# Altium project iPlug1.0.PrjPcb
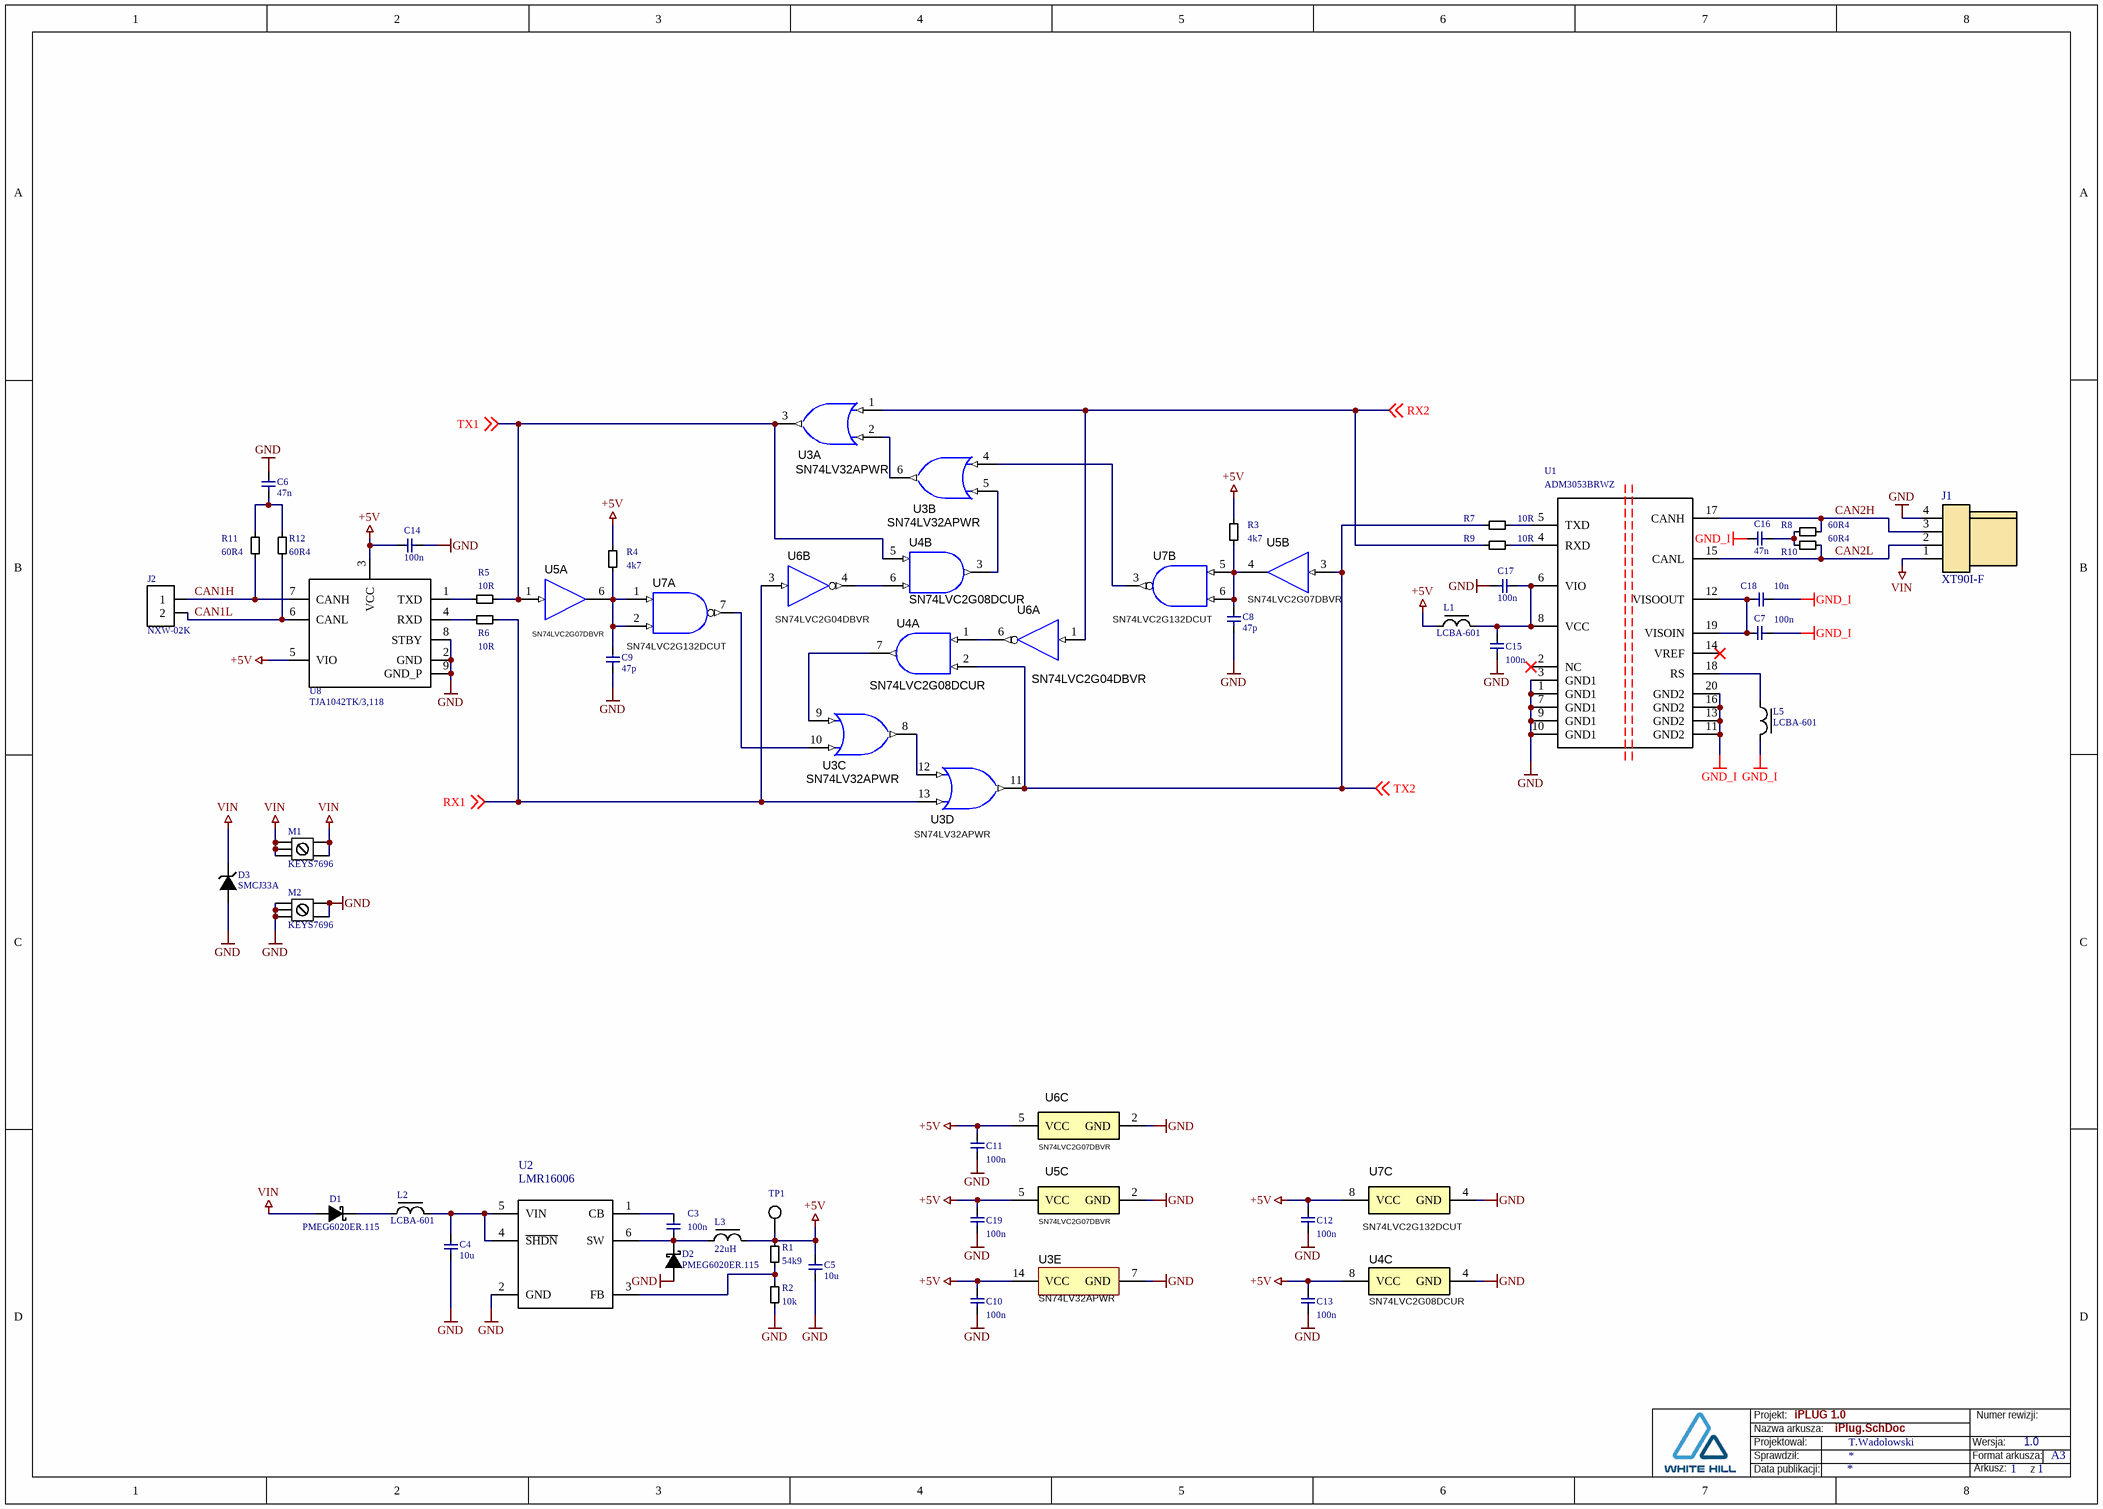
[diagram p0: iPlug.SchDoc]
PRJ_Title: iPLUG 1.0
1 sheet, 50 parts. Net scope: global (net labels, ports and power ports of the same name join across sheets).
Board file: iPlug.PcbDoc

## Sheet iPlug.SchDoc
size A3; Engineer: T.Wadolowski; Address1: ul. Żurawia 71; Address2: 15-540 Bialystok; DocumentNumber: 1.0; SheetNumber: 1; SheetTotal: 1

### Parts
(Parts that share a designator on the sheet are numbered #1, #2 ... from top to bottom, then left to right.)
C3  100n  [C0603]
C4  10u  [C1206]
C5  10u  [C1206]
C6  47n  [C0603]
C7  100n  [C0603]
C8  47p  [C0603]
C9  47p  [C0603]
C10  100n  [C0603]
C11  100n  [C0603]
C12  100n  [C0603]
C13  100n  [C0603]
C14  100n  [C0603]
C15  100n  [C0603]
C16  47n  [C0603]
C17  100n  [C0603]
C18  10n  [C0603]
C19  100n  [C0603]
D1  PMEG6020ER.115  [SOD123]
D2  PMEG6020ER.115  [SOD123]
D3  SMCJ33A  [DO-214AC]
J1  XT90I-F  (graphical)
J2  NXW-02K  [JST-2-2-H]
L1  LCBA-601  [R0603]
L2  LCBA-601  [R0603]
L3  22uH  [L4040]
L5  LCBA-601  [R0603]
M1  KEYS7696  [KEY-7696]
M2  KEYS7696  [KEY-7696]
R1  54k9  [R0603]
R2  10k  [R0603]
R3  4k7  [R0603]
R4  4k7  [R0603]
R5  10R  [R0603]
R6  10R  [R0603]
R7  10R  [R0603]
R8  60R4  [R0603]
R9  10R  [R0603]
R10  60R4  [R0603]
R11  60R4  [R0603]
R12  60R4  [R0603]
TP1  TP  [TP]  (value not drawn)  (no BOM)
U1  ADM3053BRWZ  [SOIC-20-W]
U2  LMR16006  [SOT-23-6]
U3  SN74LV32APWR  [PW0014A_N]  (parts A,B,C,D,E of 5)
U4  SN74LVC2G08DCUR  [VSSOP-8-0.5]  (parts A,B,C of 3)
U5  SN74LVC2G07DBVR  [DBV0006A_N]  (parts A,B,C of 3)
U6#1  SN74LVC2G04DBVR  [DBV0006A_N]  (parts A,B of 3)
U6#2  SN74LVC2G07DBVR  [DBV0006A_N]  (part C of 3)
U7  SN74LVC2G132DCUT  [VSSOP-8-0.5]  (parts A,B,C of 3)
U8  TJA1042TK/3,118  [HVSON8]

### Nets
+5V: C5.1 C10.1 C11.1 C12.1 C13.1 C14.1 C19.1 L1.1 L3.2 R1.2(BOT) R3.2(BOT) R4.2(BOT) TP1.1 U3.14(VCC) U4.8(VCC) U5.5(VCC) U6#2.5(VCC) U7.8(VCC) U8.3(VCC) U8.5(VIO)
GND: C4.2 C5.2 C6.1 C8.2 C9.2 C10.2 C11.2 C12.2 C13.2 C14.2 C15.2 C17.2 C19.2 D2.1(A) D3.A J1.4 M2.1 M2.2 M2.3 M2.4 M2.5 R2.1(TOP) U1.1(GND1) U1.3(GND1) U1.7(GND1) U1.9(GND1) U1.10(GND1) U2.2(GND) U3.7(GND) U4.4(GND) U5.2(GND) U6#2.2(GND) U7.4(GND) U8.2(GND) U8.8(STBY) U8.9(GND_P)
GND_I: C7.2 C16.1 C18.1 L5.2 U1.11(GND2) U1.13(GND2) U1.16(GND2) U1.20(GND2)
VIN: D1.1(A) D3.K J1.1 M1.1 M1.2 M1.3 M1.4 M1.5
CAN1H: J2.1 R11.1(TOP) U8.7(CANH)
CAN1L: J2.2 R12.1(TOP) U8.6(CANL)
CAN2H: J1.3 R8.1(TOP) U1.17(CANH)
CAN2L: J1.2 R10.1(TOP) U1.15(CANL)
RX1: R6.1(TOP) U3.13(4B) U6#1.3(2A) ; off-sheet RX1
RX2: R9.2(BOT) U3.1(1A) U6#1.1(1A) ; off-sheet RX2
TX1: R5.1(TOP) U3.3(1Y) U4.5(2A) U5.1(1A) ; off-sheet TX1
TX2: R7.2(BOT) U3.11(4Y) U4.2(1B) U5.3(2A) ; off-sheet TX2
NetC3_1: C3.1 U2.1(CB)
NetC3_2: C3.2 D2.2(K) L3.1 U2.6(SW)
NetC4_1: C4.1 L2.2 U2.4(~{SHDN}) U2.5(VIN)
NetC6_2: C6.2 R11.2(BOT) R12.2(BOT)
NetC7_1: C7.1 C18.2 U1.12(VISOOUT) U1.19(VISOIN)
NetC8_1: C8.1 R3.1(TOP) U5.4(2Y) U7.5(2A) U7.6(2B)
NetC9_1: C9.1 R4.1(TOP) U5.6(1Y) U7.1(1A) U7.2(1B)
NetC15_1: C15.1 C17.1 L1.2 U1.6(VIO) U1.8(VCC)
NetC16_2: C16.2 R8.2(BOT) R10.2(BOT)
NetD1_2: D1.2(K) L2.1
NetL5_1: L5.1 U1.18(RS)
NetR1_1: R1.1(TOP) R2.2(BOT) U2.3(FB)
NetR5_2: R5.2(BOT) U8.1(TXD)
NetR6_2: R6.2(BOT) U8.4(RXD)
NetR7_1: R7.1(TOP) U1.5(TXD)
NetR9_1: R9.1(TOP) U1.4(RXD)
NetU3_2: U3.2(1B) U3.6(2Y)
NetU3_4: U3.4(2A) U7.3(2Y)
NetU3_5: U3.5(2B) U4.3(2Y)
NetU3_8: U3.8(3Y) U3.12(4A)
NetU3_9: U3.9(3A) U4.7(1Y)
NetU3_10: U3.10(3B) U7.7(1Y)
NetU4_1: U4.1(1A) U6#1.6(1Y)
NetU4_6: U4.6(2B) U6#1.4(2Y)

Not connected (* = marked no-connect by the designer): U1 2(NC)* 14(VREF)*

### Notes on the sheet
- Projekt:
- Projektował:
- Sprawdził:
- Nazwa arkusza:
- Wersja:
- Format arkusza:
- Numer rewizji:
- A3
- Data publikacji:
- Arkusz:
- z

### Library data of the parts
C3 C7 C10-C15 C17 C19 = C-013: Capacitor: ceramic; 100nF; 50V; X7R; ±10%; SMD; 0603; Series: GRM; Manufacturer: Murata; Part Number: GRM188R71H104KA93D; Indeks: C-0013; Value: 100n; ComponentLink1Description: Datasheet; ComponentLink1URL: D:\Datasheets\.pdf; Supplier: TME; Supplier Code: GRM188R71H104KA93D; ComponentLink2Description: Dostawca; ComponentLink2URL: http://www.tme.eu/pl/katalog/?idp=1&search=GRM188R71H104KA93D
C4 C5 = C-022: Capacitor: ceramic; 10uF; 35V; X7R; ±10%; SMD; 1206; Manufacturer: Samnsung; Part Number: CL31B106KLHNNNE; Indeks: C-0019; Value: 10u; ComponentLink1Description: Datasheet; ComponentLink1URL: D:\Datasheets\.pdf; Supplier: TME; Supplier Code: CL31B106KLHNNNE; ComponentLink2Description: Dostawca; ComponentLink2URL: http://www.tme.eu/pl/katalog/?idp=1&search=CL31B106KLHNNNE
C6 C16 = C-012: Capacitor: ceramic; MLCC; 47nF; 50V; X7R; ±10%; SMD; 0603; Manufacturer: Kemet; Part Number: C0603C473K5RACTU; Indeks: C-0012; Value: 47n; ComponentLink1Description: Datasheet; ComponentLink1URL: D:\Datasheets\.pdf; Supplier: TME; Supplier Code: C0603C473K5RAC; ComponentLink2Description: Dostawca; ComponentLink2URL: http://www.tme.eu/pl/katalog/?idp=1&search=C0603C473K5RAC
C8 C9 = C-004: Capacitor: ceramic; 47pF; 100V; C0G; ±5%; SMD; 0603; Manufacturer: AVX; Part Number: 06031A470JAT2A; Value: 47p; ComponentLink1Description: Datasheet; ComponentLink1URL: D:\Datasheets\.pdf; Supplier: TME; Supplier Code: 06031A470JAT2A; Indeks: C-004; ComponentLink2Description: Dostawca; ComponentLink2URL: http://www.tme.eu/pl/katalog/?idp=1&search=06031A470JAT2A
C18 = C-011: Capacitor: ceramic; MLCC; 10nF; 50V; X7R; ±5%; SMD; 0603; Manufacturer: Vishay; Part Number: VJ0603Y103JXACW1BC; Indeks: C-0011; Value: 10n; ComponentLink1Description: Datasheet; ComponentLink1URL: D:\Datasheets\.pdf; Supplier: TME; Supplier Code: VJ0603Y103JXACW1BC; ComponentLink2Description: Dostawca; ComponentLink2URL: http://www.tme.eu/pl/katalog/?idp=1&search=VJ0603Y103JXACW1BC
D1 D2 = STPS2H100A: Diode: Schottky rectifying; SMD; 60V; 2A; SOD123W; Manufacturer: Nexperia; ComponentLink1Description: Datasheet; ComponentLink1URL: E:\Datasheets\PMEG6020ER.115.pdf; Supplier: TME; Supplier Code: PMEG6020ER.115; ComponentLink2Description: Dostawca; ComponentLink2URL: http://www.tme.eu/pl/katalog/?idp=1&search=PMEG6020ER.115; Value: PMEG6020ER.115
D3 = D_Transil_Uni: Transil; Manufacturer: ST; ComponentLink1Description: Datasheet; ComponentLink1URL: E:\Datasheets\; Supplier: TME; Supplier Code: SMCJ33A; ComponentLink2Description: Dostawca; ComponentLink2URL: http://www.tme.eu/pl/katalog/?idp=1&search=; Value: SMCJ33A
J1 = XT90I-F: Złącze; Manufacturer: Amass; Value: XT90I-F; ComponentLink1Description: Datasheet; ComponentLink1URL: D:\Datasheets\.pdf; Part Number: XT90I-F; Supplier: TME; Supplier Code: XT90I-F; ComponentLink2Description: Dostawca; ComponentLink2URL: https://www.tme.eu/pl/katalog/?search=XT90I-F
J2 = NXW-02K: Socket; wire-board; male; angled 2mm; PIN:2; THT; 1A; tinned; Manufacturer: Ninigi; Value: NXW-02K; ComponentLink1Description: Datasheet; ComponentLink1URL: D:\Datasheets\.pdf; Part Number: NXW-02K; Supplier: TME; Supplier Code: NXW-02K; ComponentLink2Description: Dostawca; ComponentLink2URL: http://www.tme.eu/pl/katalog/?idp=1&search=NXW-02K
L1 L2 L5 = LCBA-601: Ferrite: bead; Imp.@ 100MHz:600Ohm; Mounting: SMD; 1A; Case:0603; Manufacturer: Ferrocore; Indeks: IND; Supplier: TME; Supplier Code: LCBA-601; ComponentLink1Description: Datasheet; ComponentLink1URL: D:\Datasheets\.pdf; Part Number: LCBA-601; ComponentLink2Description: Dostawca; Value: LCBA-601
L3 = L4040: Inductor: wire; SMD; 1515; 22uH; 790mA; 0.37R; 4x4x1.65mm; Manufacturer: Murata; Part Number: LQH44PN220MP0L; Indeks: IND; Supplier: TME; Supplier Code: LQH44PN220MP0L; ComponentLink1Description: Datasheet; ComponentLink1URL: D:\Datasheets\.pdf; ComponentLink2Description: Dostawca; Value: 22uH
M1 M2 = M3 pcb: Terminal: screw terminal; THT, screw terminal; silver; 7x5mm; Manufacturer: Keystone; Part Number: 7696; Value: KEYS7696; ComponentLink1Description: Datasheet; ComponentLink1URL: E:\Datasheets\7696.pdf; Supplier: TME; Supplier Code: KEYS7696; ComponentLink2Description: Dostawca
R1 = R-016: Resistor: thick film; SMD; 0603; 54.9k; 0.1W; ±1%;; Manufacturer: Yageo; Part Number: RC0603FR-0754K9L; Value: 54k9; ComponentLink1Description: Datasheet; ComponentLink1URL: D:\Datasheets\.pdf; Supplier: TME; Supplier Code: RC0603FR-0754K9L; Indeks: R-016; ComponentLink2Description: Dostawca; ComponentLink2URL: http://www.tme.eu/pl/katalog/?idp=1&search=RC0603FR-0754K9L; Tolerance: 1%
R2 = R-012: Resistor: thick film; SMD; 0603; 10k; 0.125W; ±5%; Manufacturer: Walsin; Part Number: WF06P103JTL; Indeks: R-011; Value: 10k; ComponentLink1Description: Datasheet; ComponentLink1URL: D:\Datasheets\.pdf; Supplier: TME; Supplier Code: WF06P-10K-5%; ComponentLink2Description: Dostawca; ComponentLink2URL: http://www.tme.eu/pl/katalog/?idp=1&search=WF06P-10K-5%; Tolerance: 5%
R3 R4 = R-011: Resistor: thick film; SMD; 0603; 4.7k; 0.125W; ±5%; Manufacturer: Walsin; Part Number: WF06P472JTL; Value: 4k7; ComponentLink1Description: Datasheet; ComponentLink1URL: D:\Datasheets\.pdf; Supplier: TME; Supplier Code: WF06P-4K7-5%; Indeks: R-011; ComponentLink2Description: Dostawca; ComponentLink2URL: http://www.tme.eu/pl/katalog/?idp=1&search=WF06P-4K7-5%; Tolerance: 5%
R5-R7 R9 = R-001: Resistor: thick film; SMD; 0603; 10R; 0.1W; ±5%; Manufacturer: Royal Ohm; Part Number: 0603SAJ0100T5E; Value: 10R; ComponentLink1Description: Datasheet; ComponentLink1URL: D:\Datasheets\.pdf; Supplier: TME; Supplier Code: SMD0603-10R; Indeks: R-001; ComponentLink2Description: Dostawca; ComponentLink2URL: http://www.tme.eu/pl/katalog/?idp=1&search=SMD0603-10R; Tolerance: 5%
R8 R10-R12 = R-044: Resistor: thick film; SMD; 0603; 60R4; 0.1W;; Manufacturer: Royal Ohm; Part Number: 0603SAF604JT5E; Tolerance: 1%; Value: 60R4; ComponentLink1Description: Datasheet; ComponentLink1URL: D:\Datasheets\.pdf; Supplier: TME; Supplier Code: SMD0603-60R4-1%; Indeks: R-044; ComponentLink2Description: Dostawca; ComponentLink2URL: http://www.tme.eu/pl/katalog/?idp=1&search=SMD0603-60R4-1%
TP1 = TP: Test point; ComponentLink1Description: Datasheet; ComponentLink1URL: D:\Datasheets\.pdf; ComponentLink2Description: Dostawca
U1 = ADM3053BRWZ: Signal and Power Isolated CAN Transceiver with Integrated Isolated DC-to-DC Converter; Manufacturer: Analog Devices; Part Number: ADM3053BRWZ-REEL7; Value: ADM3053BRWZ; ComponentLink1Description: Datasheet; ComponentLink1URL: E:\Datasheets\ADM3053.pdf; Supplier: TME; Supplier Code: ADM3053BRWZ-REEL7; ComponentLink2Description: Dostawca; ComponentLink2URL: http://www.tme.eu/pl/katalog/?idp=1&search=ADM3053BRWZ-REEL7
U2 = LMR16006: 60 V 0.6 A Buck Regulators With High Efficiency ECO  Mode; Manufacturer: ST; Part Number: LMR16006XDDCR; Supplier Code: 2781719; ComponentLink1URL: E:\Datasheets\lmr16006.pdf; ComponentLink1Description: Datasheet; Supplier: Farnell; ComponentLink2Description: Dostawca; ComponentLink2URL: http://pl.farnell.com/search?st=2781719; Value: LMR16006
U3 = CMP-0050867-1: Quadruple 2-Input Positive-OR Gates, PW0014A, LARGE T&R; Output Drive (IOL/IOH)(Max)(mA): 50/-50; Bits(#): 4; Voltage(Nom)(V): 2.5,3.3,5; Output Type: TTL; tpd @ Nom Voltage(Max)(ns): 19,13,8.5; PackageVersion: http://www.ti.com/lit/ml/mpds360/mpds360.pdf; Supplier code: 2342502; Supplier: Farnell; PartNumber: SN74LV32APWR
U4 = SN74LVC2G08DCUR: Dual 2-Input Positive-AND Gate, DCU0008A, LARGE T&R; DatasheetVersion: SCES198M; PackageReference: DCU0008A; Supplier 1: Mouser; Supplier Part Number 1: 595-SN74LVC2G08DCUR; Supplier 2: Digi-Key; Supplier Part Number 2: 296-13264-2-ND; Supplier 3: Digi-Key; Supplier Part Number 3: 296-13264-1-ND; Supplier 4: Digi-Key; Supplier Part Number 4: 296-13264-6-ND; PartNumber: SN74LVC2G08DCUR; ComponentLink1Description: Manufacturer URL; ComponentLink1URL: http://www.ti.com/; ComponentLink2Description: Datasheet; ComponentLink2URL: http://www.ti.com/lit/ds/symlink/sn74lvc2g08.pdf; Supplier: Farnell; Supplier code: 3120647
U5 U6#2 = SN74LVC2G07DBVR: Dual Buffer/Driver with Open-Drain Output, DBV0006A, LARGE T&R; Manufacturer: Texas Instruments; VCC(Min)(V): 1.65; VCC(Max)(V): 5.5; Output Type: CMOS; ICC @ Nom Voltage(Max)(mA): 0.01; Input Type: CMOS/TTL; Bits(#): 2; F @ Nom Voltage(Max)(Mhz): 150; Rating: Catalog; Technology Family: LVC; Voltage(Nom)(V): 1.8,2.5,3.3,5; Schmitt Trigger: No; Output Drive (IOL/IOH)(Max)(mA): 32/-32; tpd @ Nom Voltage(Max)(ns): 8.6,4.4,3.7,2.9; Logic: True; Sub-Family: Inverting Buffer/Driver; DatasheetVersion: SCES308K; PackageReference: DBV0006A; Supplier 1: Mouser; Supplier Part Number 1: 595-SN74LVC2G07DBVR; Supplier 2: Digi-Key; Supplier Part Number 2: 296-13494-2-ND; Supplier 3: Digi-Key; Supplier Part Number 3: 296-13494-1-ND; Supplier 4: Digi-Key; Supplier Part Number 4: 296-13494-6-ND; Generic Part Number: SN74LVC2G07; Operating Temperature Range(C): -40 to 125; 3-State Output: No; PartNumber: SN74LVC2G07DBVR; ComponentLink1Description: Manufacturer URL; ComponentLink1URL: http://www.ti.com/; ComponentLink2Description: Datasheet; ComponentLink2URL: http://www.ti.com/lit/ds/symlink/sn74lvc2g07.pdf; Supplier: Farnell
  U5: Supplier code: 3119641
  U6#2: Supplier code: 1417293
U6#1 = SN74LVC2G04DBVR: Dual Inverter, DBV0006A, LARGE T&R; Manufacturer: Texas Instruments; VCC(Min)(V): 1.65; VCC(Max)(V): 5.5; Output Type: CMOS; ICC @ Nom Voltage(Max)(mA): 0.01; Input Type: CMOS/TTL; Bits(#): 2; F @ Nom Voltage(Max)(Mhz): 150; Rating: Catalog; Technology Family: LVC; Voltage(Nom)(V): 1.8,2.5,3.3,5; Schmitt Trigger: No; Output Drive (IOL/IOH)(Max)(mA): 32/-32; tpd @ Nom Voltage(Max)(ns): 8,4.9,4.6,3.7; Logic: Inverting; Sub-Family: Inverting Buffer/Driver; DatasheetVersion: SCES195M; PackageReference: DBV0006A; Supplier 1: Mouser; Supplier Part Number 1: 595-SN74LVC2G04DBVR; Supplier 2: Digi-Key; Supplier Part Number 2: 296-13261-2-ND; Supplier 3: Digi-Key; Supplier Part Number 3: 296-13261-1-ND; Supplier 4: Digi-Key; Supplier Part Number 4: 296-13261-6-ND; Generic Part Number: SN74LVC2G04; Operating Temperature Range(C): -40 to 125; 3-State Output: No; PartNumber: SN74LVC2G04DBVR; ComponentLink1Description: Manufacturer URL; ComponentLink1URL: http://www.ti.com/; ComponentLink2Description: Datasheet; ComponentLink2URL: http://www.ti.com/lit/ds/symlink/sn74lvc2g04.pdf; Supplier: Farnell; Supplier code: 1417293
U7 = SN74LVC2G132DCTR: Dual 2-Input NAND Gate with Schmitt-Trigger Inputs; PartNumber: SN74LVC2G132DCUT; ComponentLink1Description: Datasheet; ComponentLink1URL: E:\Datasheets\SN74LVC2G132DCTR.pdf; ComponentLink2Description: Dostawca; ComponentLink2URL: http://pl.farnell.com//3120651; Supplier: Farnell; Supplier Code: 3120651; Value: SN74LVC2G132
U8 = TJA1042TK/3.118: CAN transceiver,wake up;5Mbps; Manufacturer: NXP; Value: TJA1042TK/3,118; ComponentLink1Description: Datasheet; ComponentLink1URL: E:\Datasheets\TJA1042T.pdf; Part Number: TJA1042TK/3,118; Supplier: Farnell; Supplier Code: 2400548; ComponentLink2Description: Dostawca; ComponentLink2URL: https://pl.farnell.com/search?st=2400548